# Altium schematic sheet Eprom.SchDoc
size A4
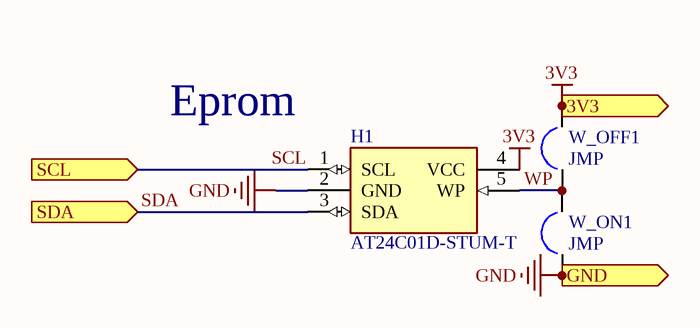
[diagram p0: Eprom.SchDoc]

## Parts
H1  AT24C01D-STUM-T  [SOT95P280X145-5N]
W_OFF1  JMP  [JMP]
W_ON1  JMP  [JMP]

## Ports
3V3 (in), GND (in), SCL (in), SDA (in)

## Nets
3V3: H1.4(VCC) W_OFF1.2 ; port 3V3
GND: H1.2(GND) W_ON1.1 ; port GND
SCL: H1.1(SCL) ; port SCL
SDA: H1.3(SDA) ; port SDA
WP: H1.5(WP) W_OFF1.1 W_ON1.2

## Notes on the sheet
- (near H1) Eprom

## Library data of the parts
H1 = AT24C01D-STUM-T: Hardware; Manufacturer_Name: Microchip; Datasheet Link: https://componentsearchengine.com/Datasheets/1/AT24C01D-STUM-T.pdf; Height: 1.45mm; Manufacturer_Part_Number: AT24C01D-STUM-T; Mouser Part Number: 556-AT24C01D-STUM-T; Mouser Price/Stock: https://www.mouser.com/Search/Refine.aspx?Keyword=556-AT24C01D-STUM-T; RS Part Number: 8988614; RS Price/Stock: https://uk.rs-online.com/web/p/products/8988614